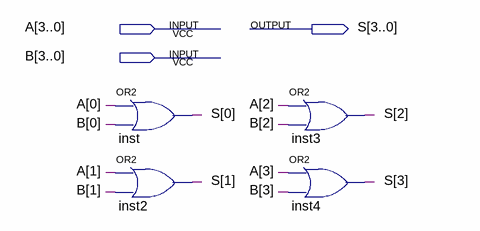
[diagram p0: schematic sheet]
// Quartus schematic OR4b.bdf as structural Verilog: 4 symbols, 3 pins
module OR4b (
  input  [3:0] A,
  input  [3:0] B,
  output [3:0] S
);

  or inst (S[0], A[0], B[0]);
  or inst2 (S[1], A[1], B[1]);
  or inst3 (S[2], A[2], B[2]);
  or inst4 (S[3], A[3], B[3]);
endmodule
